# Altium schematic sheet ClearNote_MAIN.SchDoc
size A; SheetNumber: 1; SheetTotal: 7
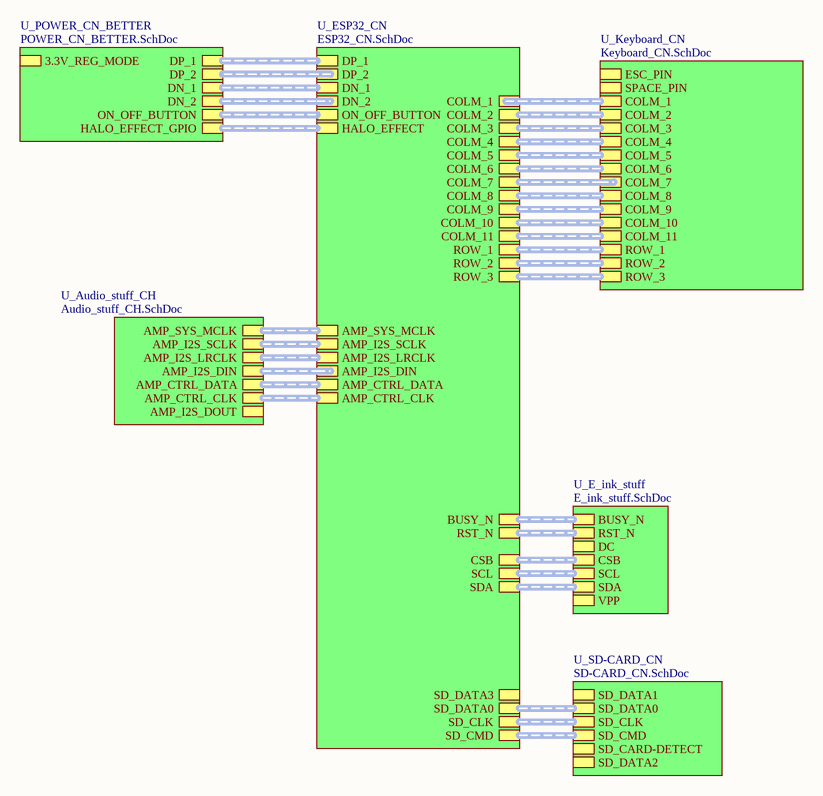
[diagram p0: ClearNote_MAIN.SchDoc]

## Sub-sheets
U_Audio_stuff_CH = Audio_stuff_CH.SchDoc: AMP_CTRL_CLK, AMP_CTRL_DATA, AMP_I2S_SCLK, AMP_SYS_MCLK, AMP_I2S_LRCLK, AMP_I2S_DIN, AMP_I2S_DOUT
U_E_ink_stuff = E_ink_stuff.SchDoc: BUSY_N, RST_N, DC, CSB, SCL, SDA, VPP
U_ESP32_CN = ESP32_CN.SchDoc: DP_1, DP_2, DN_1, DN_2, ON_OFF_BUTTON, HALO_EFFECT, ROW_1, ROW_2, ROW_3, COLM_1, COLM_2, COLM_3, COLM_4, COLM_5, COLM_6, COLM_7, COLM_8, COLM_9, COLM_10, COLM_11, AMP_SYS_MCLK, AMP_I2S_SCLK, AMP_I2S_LRCLK, AMP_I2S_DIN, AMP_CTRL_DATA, AMP_CTRL_CLK, SD_CLK, SCL, SD_CMD, SDA, SD_DATA0, CSB, RST_N, SD_DATA3, BUSY_N
U_Keyboard_CN = Keyboard_CN.SchDoc: ESC_PIN, SPACE_PIN, COLM_1, COLM_2, COLM_3, COLM_4, COLM_5, COLM_6, COLM_7, COLM_8, COLM_9, COLM_10, COLM_11, ROW_1, ROW_2, ROW_3
U_POWER_CN_BETTER = POWER_CN_BETTER.SchDoc: 3.3V_REG_MODE, ON_OFF_BUTTON, HALO_EFFECT_GPIO, DP_1, DN_1, DN_2, DP_2
U_SD-CARD_CN = SD-CARD_CN.SchDoc: SD_DATA1, SD_DATA0, SD_CLK, SD_CMD, SD_CARD-DETECT, SD_DATA2

## Buses and harness runs
harness sheet U_Audio_stuff_CH/AMP_CTRL_CLK = sheet U_ESP32_CN/AMP_CTRL_CLK
harness sheet U_Audio_stuff_CH/AMP_CTRL_DATA = sheet U_ESP32_CN/AMP_CTRL_DATA
harness sheet U_Audio_stuff_CH/AMP_I2S_DIN = sheet U_ESP32_CN/AMP_I2S_DIN
harness sheet U_Audio_stuff_CH/AMP_I2S_LRCLK = sheet U_ESP32_CN/AMP_I2S_LRCLK
harness sheet U_Audio_stuff_CH/AMP_I2S_SCLK = sheet U_ESP32_CN/AMP_I2S_SCLK
harness sheet U_Audio_stuff_CH/AMP_SYS_MCLK = sheet U_ESP32_CN/AMP_SYS_MCLK
harness sheet U_E_ink_stuff/BUSY_N = sheet U_ESP32_CN/BUSY_N
harness sheet U_E_ink_stuff/CSB = sheet U_ESP32_CN/CSB
harness sheet U_E_ink_stuff/RST_N = sheet U_ESP32_CN/RST_N
harness sheet U_E_ink_stuff/SCL = sheet U_ESP32_CN/SCL
harness sheet U_E_ink_stuff/SDA = sheet U_ESP32_CN/SDA
harness sheet U_ESP32_CN/COLM_1 = sheet U_Keyboard_CN/COLM_1
harness sheet U_ESP32_CN/COLM_2 = sheet U_Keyboard_CN/COLM_2
harness sheet U_ESP32_CN/COLM_3 = sheet U_Keyboard_CN/COLM_3
harness sheet U_ESP32_CN/COLM_4 = sheet U_Keyboard_CN/COLM_4
harness sheet U_ESP32_CN/COLM_5 = sheet U_Keyboard_CN/COLM_5
harness sheet U_ESP32_CN/COLM_6 = sheet U_Keyboard_CN/COLM_6
harness sheet U_ESP32_CN/COLM_7 = sheet U_Keyboard_CN/COLM_7
harness sheet U_ESP32_CN/COLM_8 = sheet U_Keyboard_CN/COLM_8
harness sheet U_ESP32_CN/COLM_9 = sheet U_Keyboard_CN/COLM_9
harness sheet U_ESP32_CN/COLM_10 = sheet U_Keyboard_CN/COLM_10
harness sheet U_ESP32_CN/COLM_11 = sheet U_Keyboard_CN/COLM_11
harness sheet U_ESP32_CN/DN_1 = sheet U_POWER_CN_BETTER/DN_1
harness sheet U_ESP32_CN/DN_2 = sheet U_POWER_CN_BETTER/DN_2
harness sheet U_ESP32_CN/DP_1 = sheet U_POWER_CN_BETTER/DP_1
harness sheet U_ESP32_CN/DP_2 = sheet U_POWER_CN_BETTER/DP_2
harness sheet U_ESP32_CN/HALO_EFFECT = sheet U_POWER_CN_BETTER/HALO_EFFECT_GPIO
harness sheet U_ESP32_CN/ON_OFF_BUTTON = sheet U_POWER_CN_BETTER/ON_OFF_BUTTON
harness sheet U_ESP32_CN/ROW_1 = sheet U_Keyboard_CN/ROW_1
harness sheet U_ESP32_CN/ROW_2 = sheet U_Keyboard_CN/ROW_2
harness sheet U_ESP32_CN/ROW_3 = sheet U_Keyboard_CN/ROW_3
harness sheet U_ESP32_CN/SD_CLK = sheet U_SD-CARD_CN/SD_CLK
harness sheet U_ESP32_CN/SD_CMD = sheet U_SD-CARD_CN/SD_CMD
harness sheet U_ESP32_CN/SD_DATA0 = sheet U_SD-CARD_CN/SD_DATA0